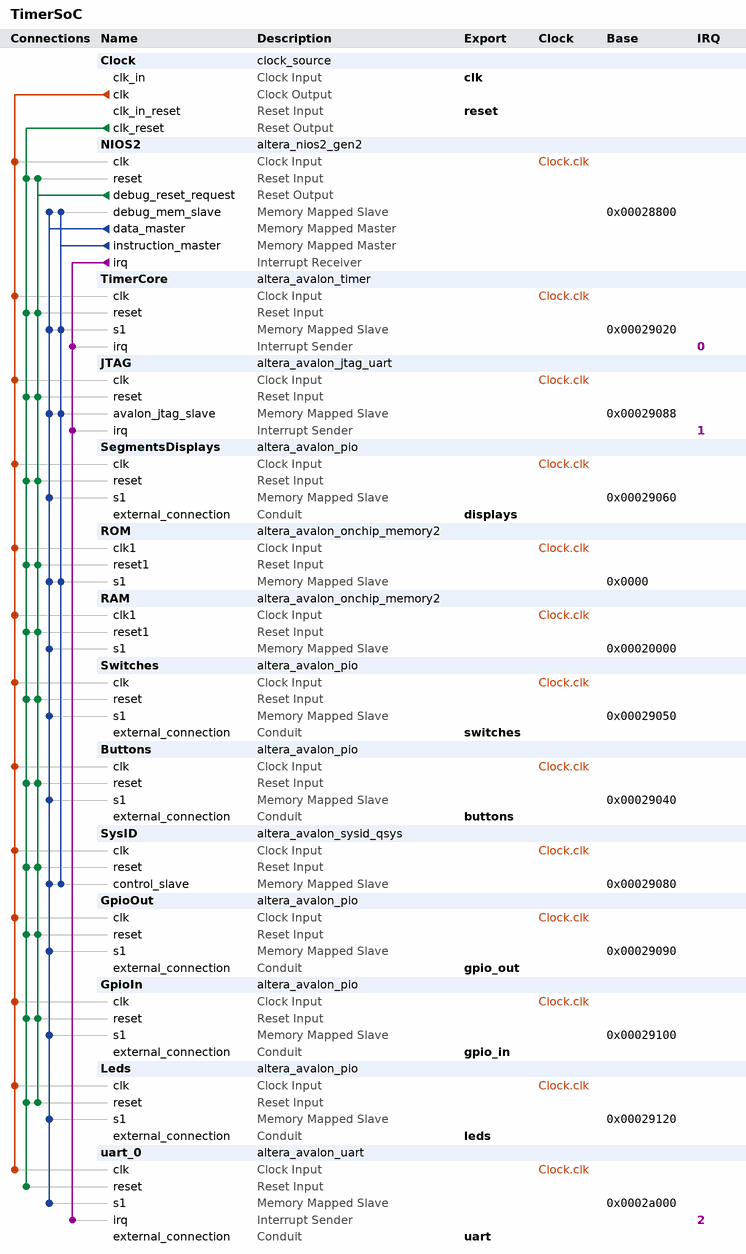
[diagram p0: system contents]
# Platform Designer (Qsys) system TimerSoC, Cyclone V 5CSEMA5F31C6
# Parameters at their usual value, and those the tool derives, are not listed.
package require -exact qsys 18.1
create_system TimerSoC
set_project_property DEVICE_FAMILY {Cyclone V}
set_project_property DEVICE 5CSEMA5F31C6

add_instance Clock clock_source 18.1
set_instance_parameter_value Clock clockFrequency 50000000

add_instance NIOS2 altera_nios2_gen2 18.1
set_instance_parameter_value NIOS2 dcache_size 2048
set_instance_parameter_value NIOS2 exceptionSlave ROM.s1
set_instance_parameter_value NIOS2 icache_size 4096
set_instance_parameter_value NIOS2 impl Tiny
set_instance_parameter_value NIOS2 resetSlave ROM.s1

add_instance TimerCore altera_avalon_timer 18.1
set_instance_parameter_value TimerCore fixedPeriod true
set_instance_parameter_value TimerCore period 1
set_instance_parameter_value TimerCore periodUnits SEC

add_instance JTAG altera_avalon_jtag_uart 18.1
set_instance_parameter_value JTAG simInteractiveOptions NO_INTERACTIVE_WINDOWS

add_instance SegmentsDisplays altera_avalon_pio 18.1
set_instance_parameter_value SegmentsDisplays direction Output
set_instance_parameter_value SegmentsDisplays width 32

add_instance ROM altera_avalon_onchip_memory2 18.1
set_instance_parameter_value ROM dataWidth 32
set_instance_parameter_value ROM dualPort false
set_instance_parameter_value ROM initMemContent true
set_instance_parameter_value ROM initializationFileName onchip_mem.hex
set_instance_parameter_value ROM memorySize 81920
set_instance_parameter_value ROM writable false

add_instance RAM altera_avalon_onchip_memory2 18.1
set_instance_parameter_value RAM dataWidth 32
set_instance_parameter_value RAM dualPort false
set_instance_parameter_value RAM initMemContent true
set_instance_parameter_value RAM initializationFileName onchip_mem.hex
set_instance_parameter_value RAM memorySize 32768

add_instance Switches altera_avalon_pio 18.1
set_instance_parameter_value Switches direction Input
set_instance_parameter_value Switches width 2

add_instance Buttons altera_avalon_pio 18.1
set_instance_parameter_value Buttons direction Input
set_instance_parameter_value Buttons width 2

add_instance SysID altera_avalon_sysid_qsys 18.1
set_instance_parameter_value SysID id 0

add_instance GpioOut altera_avalon_pio 18.1
set_instance_parameter_value GpioOut direction Output
set_instance_parameter_value GpioOut width 8

add_instance GpioIn altera_avalon_pio 18.1
set_instance_parameter_value GpioIn direction Input
set_instance_parameter_value GpioIn width 8

add_instance Leds altera_avalon_pio 18.1
set_instance_parameter_value Leds direction Output
set_instance_parameter_value Leds width 10

add_instance uart_0 altera_avalon_uart 18.1
set_instance_parameter_value uart_0 baud 115200
set_instance_parameter_value uart_0 dataBits 8
set_instance_parameter_value uart_0 fixedBaud true
set_instance_parameter_value uart_0 parity NONE
set_instance_parameter_value uart_0 stopBits 1

# connections
add_connection Clock.clk Buttons.clk clock
add_connection Clock.clk GpioIn.clk clock
add_connection Clock.clk GpioOut.clk clock
add_connection Clock.clk JTAG.clk clock
add_connection Clock.clk Leds.clk clock
add_connection Clock.clk NIOS2.clk clock
add_connection Clock.clk RAM.clk1 clock
add_connection Clock.clk ROM.clk1 clock
add_connection Clock.clk SegmentsDisplays.clk clock
add_connection Clock.clk Switches.clk clock
add_connection Clock.clk SysID.clk clock
add_connection Clock.clk TimerCore.clk clock
add_connection Clock.clk uart_0.clk clock
add_connection Clock.clk_reset Buttons.reset reset
add_connection Clock.clk_reset GpioIn.reset reset
add_connection Clock.clk_reset GpioOut.reset reset
add_connection Clock.clk_reset JTAG.reset reset
add_connection Clock.clk_reset Leds.reset reset
add_connection Clock.clk_reset NIOS2.reset reset
add_connection Clock.clk_reset RAM.reset1 reset
add_connection Clock.clk_reset ROM.reset1 reset
add_connection Clock.clk_reset SegmentsDisplays.reset reset
add_connection Clock.clk_reset Switches.reset reset
add_connection Clock.clk_reset SysID.reset reset
add_connection Clock.clk_reset TimerCore.reset reset
add_connection Clock.clk_reset uart_0.reset reset
add_connection NIOS2.debug_reset_request Buttons.reset reset
add_connection NIOS2.debug_reset_request GpioIn.reset reset
add_connection NIOS2.debug_reset_request GpioOut.reset reset
add_connection NIOS2.debug_reset_request JTAG.reset reset
add_connection NIOS2.debug_reset_request Leds.reset reset
add_connection NIOS2.debug_reset_request NIOS2.reset reset
add_connection NIOS2.debug_reset_request RAM.reset1 reset
add_connection NIOS2.debug_reset_request ROM.reset1 reset
add_connection NIOS2.debug_reset_request SegmentsDisplays.reset reset
add_connection NIOS2.debug_reset_request Switches.reset reset
add_connection NIOS2.debug_reset_request SysID.reset reset
add_connection NIOS2.debug_reset_request TimerCore.reset reset
add_connection NIOS2.data_master Buttons.s1 avalon
set_connection_parameter_value NIOS2.data_master/Buttons.s1 baseAddress 0x00029040
add_connection NIOS2.data_master GpioIn.s1 avalon
set_connection_parameter_value NIOS2.data_master/GpioIn.s1 baseAddress 0x00029100
add_connection NIOS2.data_master GpioOut.s1 avalon
set_connection_parameter_value NIOS2.data_master/GpioOut.s1 baseAddress 0x00029090
add_connection NIOS2.data_master JTAG.avalon_jtag_slave avalon
set_connection_parameter_value NIOS2.data_master/JTAG.avalon_jtag_slave baseAddress 0x00029088
add_connection NIOS2.data_master Leds.s1 avalon
set_connection_parameter_value NIOS2.data_master/Leds.s1 baseAddress 0x00029120
add_connection NIOS2.data_master NIOS2.debug_mem_slave avalon
set_connection_parameter_value NIOS2.data_master/NIOS2.debug_mem_slave baseAddress 0x00028800
add_connection NIOS2.data_master RAM.s1 avalon
set_connection_parameter_value NIOS2.data_master/RAM.s1 baseAddress 0x00020000
add_connection NIOS2.data_master ROM.s1 avalon
set_connection_parameter_value NIOS2.data_master/ROM.s1 baseAddress 0x0000
add_connection NIOS2.data_master SegmentsDisplays.s1 avalon
set_connection_parameter_value NIOS2.data_master/SegmentsDisplays.s1 baseAddress 0x00029060
add_connection NIOS2.data_master Switches.s1 avalon
set_connection_parameter_value NIOS2.data_master/Switches.s1 baseAddress 0x00029050
add_connection NIOS2.data_master SysID.control_slave avalon
set_connection_parameter_value NIOS2.data_master/SysID.control_slave baseAddress 0x00029080
add_connection NIOS2.data_master TimerCore.s1 avalon
set_connection_parameter_value NIOS2.data_master/TimerCore.s1 baseAddress 0x00029020
add_connection NIOS2.data_master uart_0.s1 avalon
set_connection_parameter_value NIOS2.data_master/uart_0.s1 baseAddress 0x0002a000
add_connection NIOS2.instruction_master JTAG.avalon_jtag_slave avalon
set_connection_parameter_value NIOS2.instruction_master/JTAG.avalon_jtag_slave baseAddress 0x00029088
add_connection NIOS2.instruction_master NIOS2.debug_mem_slave avalon
set_connection_parameter_value NIOS2.instruction_master/NIOS2.debug_mem_slave baseAddress 0x00028800
add_connection NIOS2.instruction_master ROM.s1 avalon
set_connection_parameter_value NIOS2.instruction_master/ROM.s1 baseAddress 0x0000
add_connection NIOS2.instruction_master SysID.control_slave avalon
set_connection_parameter_value NIOS2.instruction_master/SysID.control_slave baseAddress 0x00029080
add_connection NIOS2.instruction_master TimerCore.s1 avalon
set_connection_parameter_value NIOS2.instruction_master/TimerCore.s1 baseAddress 0x00029020
add_connection NIOS2.irq JTAG.irq interrupt
set_connection_parameter_value NIOS2.irq/JTAG.irq irqNumber 1
add_connection NIOS2.irq TimerCore.irq interrupt
set_connection_parameter_value NIOS2.irq/TimerCore.irq irqNumber 0
add_connection NIOS2.irq uart_0.irq interrupt
set_connection_parameter_value NIOS2.irq/uart_0.irq irqNumber 2

# exported interfaces
add_interface buttons conduit end
set_interface_property buttons EXPORT_OF Buttons.external_connection
add_interface clk clock sink
set_interface_property clk EXPORT_OF Clock.clk_in
add_interface displays conduit end
set_interface_property displays EXPORT_OF SegmentsDisplays.external_connection
add_interface gpio_in conduit end
set_interface_property gpio_in EXPORT_OF GpioIn.external_connection
add_interface gpio_out conduit end
set_interface_property gpio_out EXPORT_OF GpioOut.external_connection
add_interface leds conduit end
set_interface_property leds EXPORT_OF Leds.external_connection
add_interface reset reset sink
set_interface_property reset EXPORT_OF Clock.clk_in_reset
add_interface switches conduit end
set_interface_property switches EXPORT_OF Switches.external_connection
add_interface uart conduit end
set_interface_property uart EXPORT_OF uart_0.external_connection

set_interconnect_requirement {$system} qsys_mm.clockCrossingAdapter HANDSHAKE
set_interconnect_requirement {$system} qsys_mm.enableEccProtection FALSE
set_interconnect_requirement {$system} qsys_mm.insertDefaultSlave FALSE
set_interconnect_requirement {$system} qsys_mm.maxAdditionalLatency 1

save_system TimerSoC.qsys
